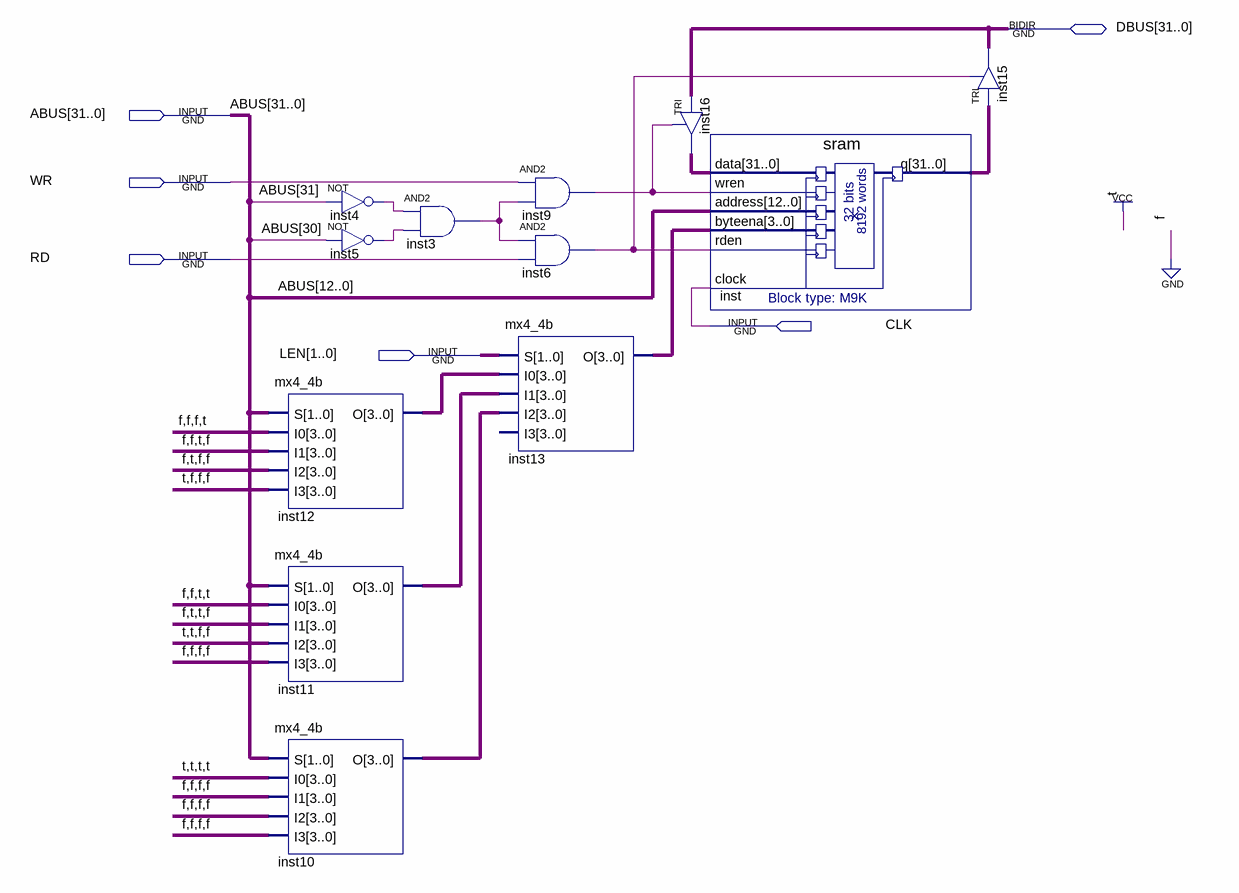
[diagram p0: schematic sheet]
// Quartus schematic sram_controller.bdf as structural Verilog: 12 symbols, 6 pins
module sram_controller (
  input  [31:0] ABUS,
  input  WR,
  input  RD,
  input  CLK,
  input  [1:0] LEN,
  inout  [31:0] DBUS
);

  wire inst3_out, inst4_out, inst5_out, inst6_out, inst9_out;
  wire [3:0] inst10_o, inst11_o, inst12_o, inst13_o;
  wire [31:0] inst16_out, inst_q;

  mx4_4b inst12 (.S(ABUS[1:0]), .I0(4'b0001), .I1(4'b0010), .I2(4'b0100), .I3(4'b1000), .O(inst12_o));
  mx4_4b inst11 (.S(ABUS[1:0]), .I0(4'b0011), .I1(4'b0110), .I2(4'b1100), .I3(4'b0000), .O(inst11_o));
  mx4_4b inst10 (.S(ABUS[1:0]), .I0(4'b1111), .I1(4'b0000), .I2(4'b0000), .I3(4'b0000), .O(inst10_o));
  not inst4 (inst4_out, ABUS[31]);
  not inst5 (inst5_out, ABUS[30]);
  and inst3 (inst3_out, inst4_out, inst5_out);
  and inst9 (inst9_out, WR, inst3_out);
  and inst6 (inst6_out, inst3_out, RD);
  mx4_4b inst13 (.S(LEN), .I0(inst12_o), .I1(inst11_o), .I2(inst10_o), .O(inst13_o));  // open: I3
  TRI inst16[31:0] (.IN(DBUS), .OE(inst9_out), .OUT(inst16_out));
  sram inst (
    .data(inst16_out), .wren(inst9_out), .address(ABUS[12:0]), .byteena(inst13_o), .rden(inst6_out),
    .clock(CLK), .q(inst_q));
  TRI inst15[31:0] (.IN(inst_q), .OE(inst6_out), .OUT(DBUS));
endmodule
